# EAGLE design Demo (EAGLE 6.5.0)
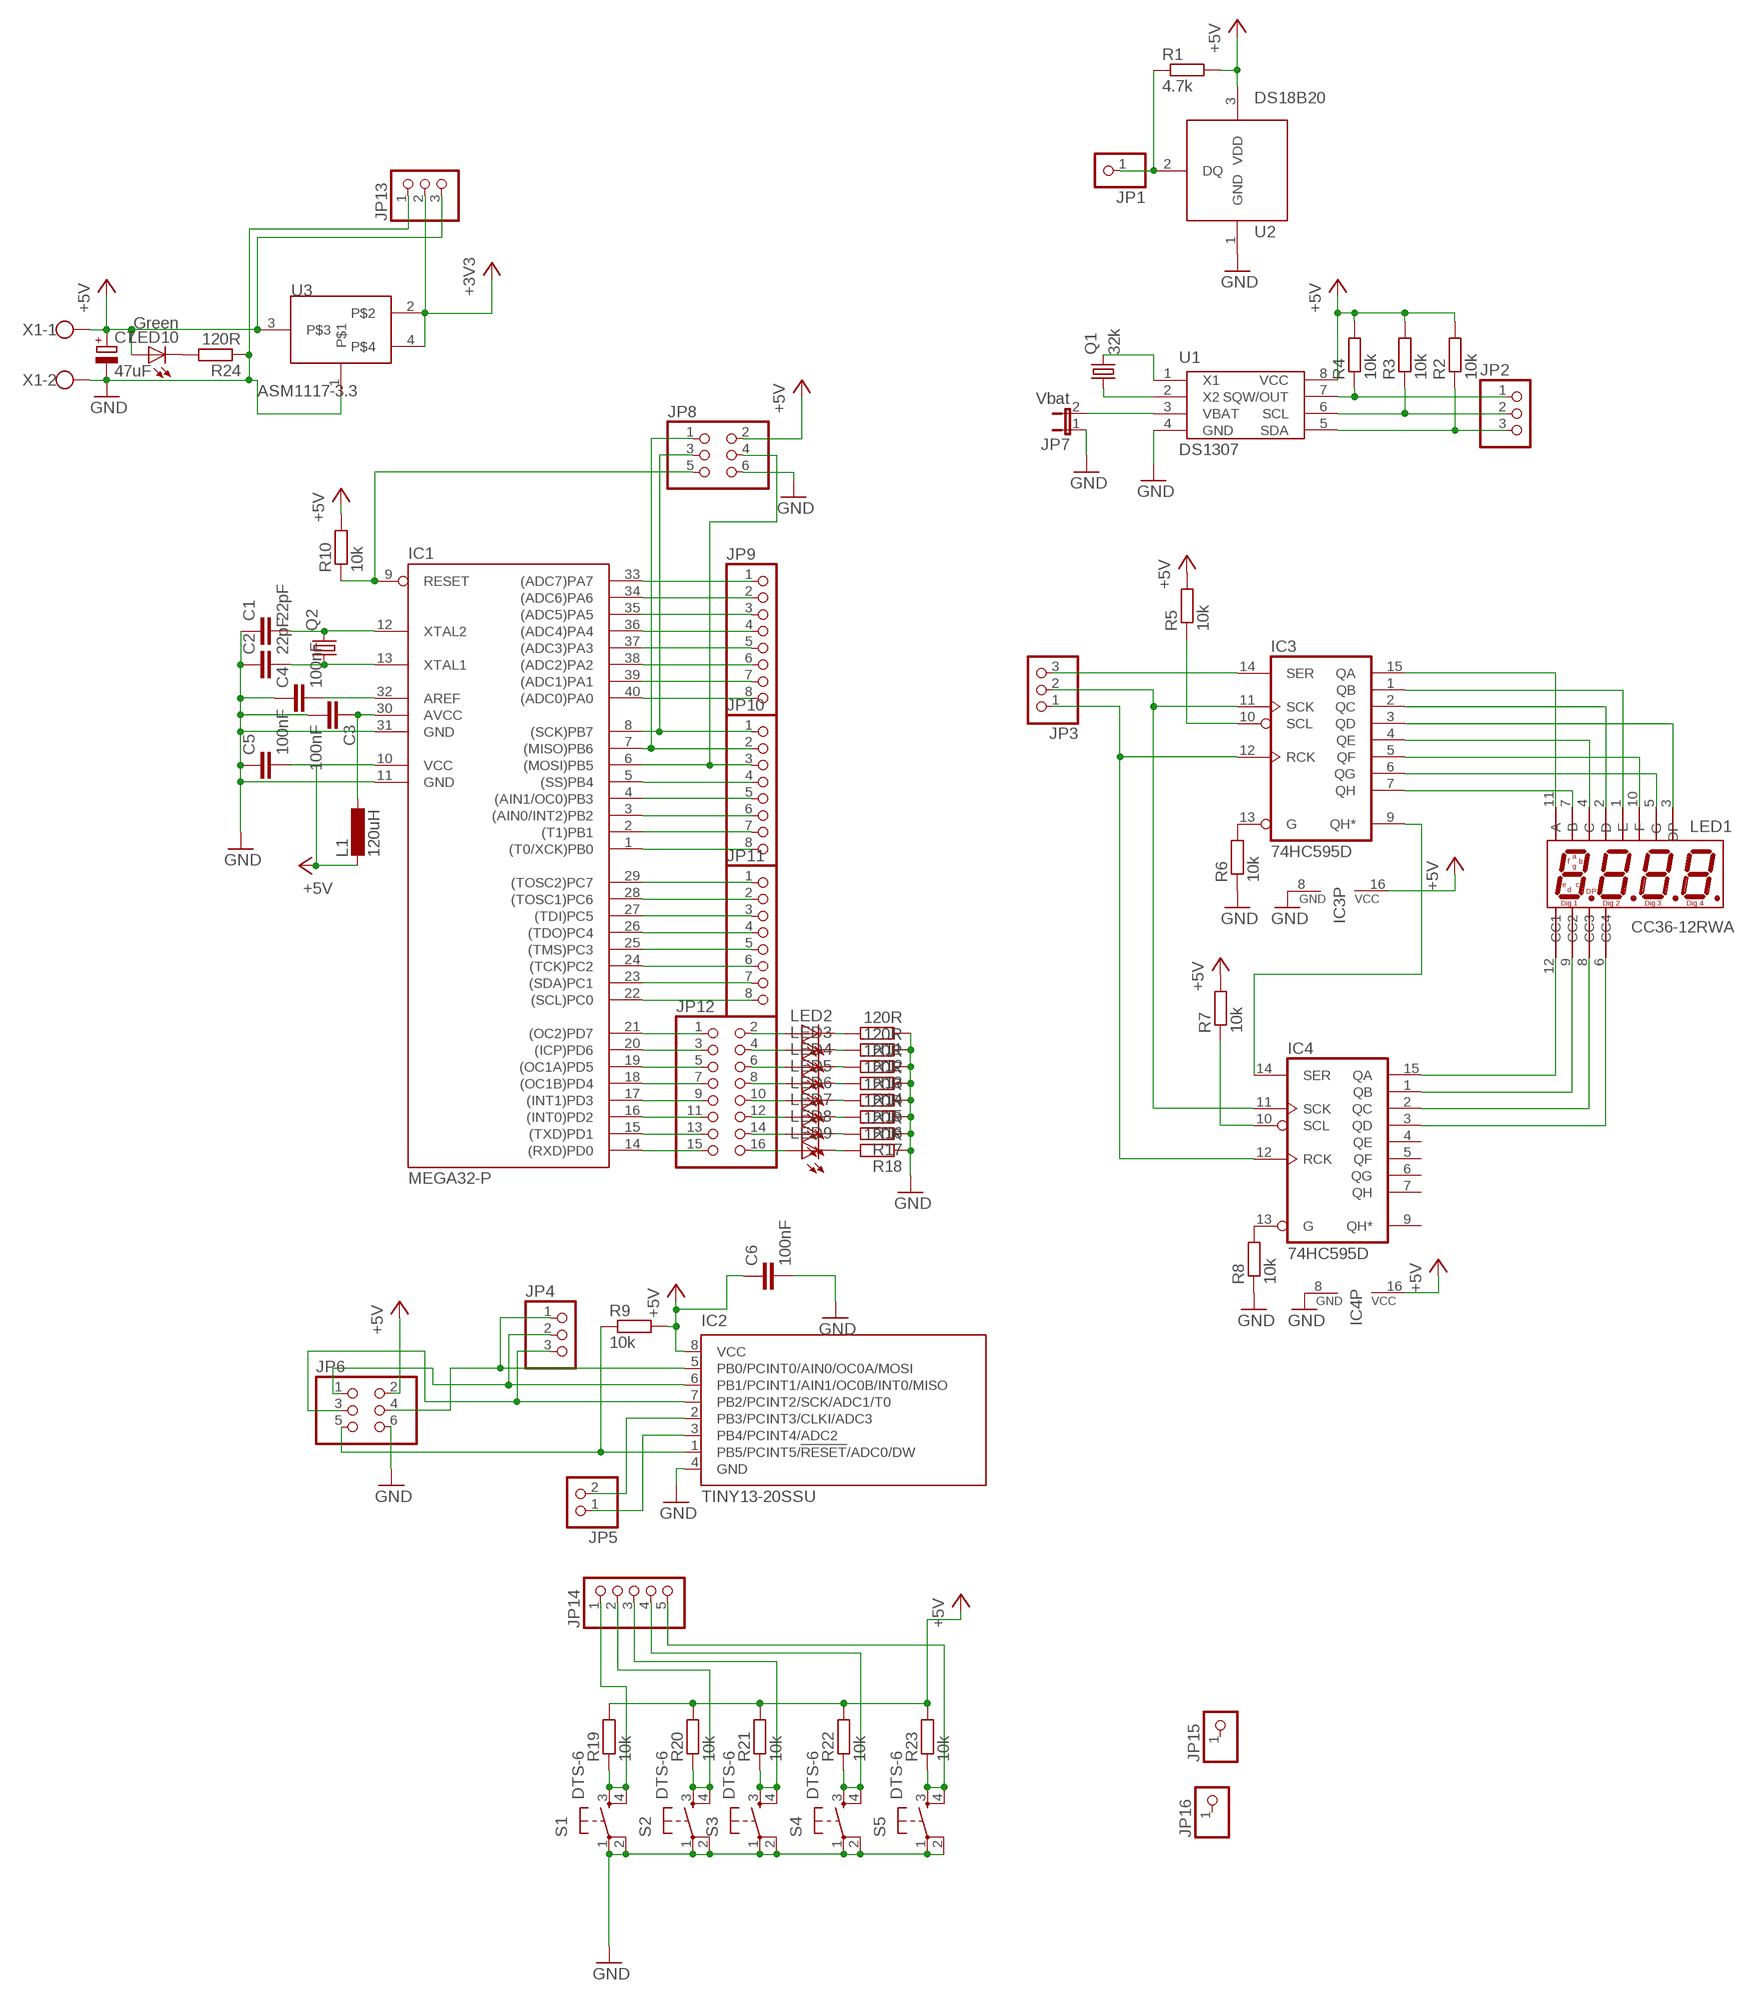
[diagram p0: schematic, sheet 1]

## Parts
C1  22pF  C-EUC0805  [C0805]
C2  22pF  C-EUC0805  [C0805]
C3  100nF  C-EUC0805  [C0805]
C4  100nF  C-EUC0805  [C0805]
C5  100nF  C-EUC0805  [C0805]
C6  100nF  C-EUC0805  [C0805]
C7  47uF  CPOL-EUE2-5  [E2-5]
IC1  MEGA32-P  [DIL40]
IC2  TINY13-20SSU  [8S1]
IC3  74HC595D  [SO16]
IC4  74HC595D  [SO16]
JP1  PINHD-1X1  [1X01]
JP2  PINHD-1X3  [1X03]
JP3  PINHD-1X3  [1X03]
JP4  PINHD-1X3  [1X03]
JP5  PINHD-1X2  [1X02]
JP6  PINHD-2X3  [2X03]
JP7  Vbat  JP1E  [JP1]
JP8  PINHD-2X3  [2X03]
JP9  PINHD-1X8  [1X08]
JP10  PINHD-1X8  [1X08]
JP11  PINHD-1X8  [1X08]
JP12  PINHD-2X8  [2X08]
JP13  PINHD-1X3  [1X03]
JP14  PINHD-1X5  [1X05]
JP15  PINHD-1X1  [1X01]
JP16  PINHD-1X1  [1X01]
L1  120uH  L-EU0204V  [0204V]
LED1  CC36-12RWA  [7SEG_4DIG]
LED2  LEDSML0603  [SML0603]
LED3  LEDSML0603  [SML0603]
LED4  LEDSML0603  [SML0603]
LED5  LEDSML0603  [SML0603]
LED6  LEDSML0603  [SML0603]
LED7  LEDSML0603  [SML0603]
LED8  LEDSML0603  [SML0603]
LED9  LEDSML0603  [SML0603]
LED10  Green  LEDSML0603  [SML0603]
Q1  32k  CRYSTALTC38H  [TC38H]
Q2  CRYSTALHC49S  [HC49/S]
R1  4.7k  R-EU_R0603  [R0603]
R2  10k  R-EU_R0603  [R0603]
R3  10k  R-EU_R0603  [R0603]
R4  10k  R-EU_R0603  [R0603]
R5  10k  R-EU_R0603  [R0603]
R6  10k  R-EU_R0603  [R0603]
R7  10k  R-EU_R0603  [R0603]
R8  10k  R-EU_R0603  [R0603]
R9  10k  R-EU_R0603  [R0603]
R10  10k  R-EU_R0603  [R0603]
R11  120R  R-EU_R0603  [R0603]
R12  120R  R-EU_R0603  [R0603]
R13  120R  R-EU_R0603  [R0603]
R14  120R  R-EU_R0603  [R0603]
R15  120R  R-EU_R0603  [R0603]
R16  120R  R-EU_R0603  [R0603]
R17  120R  R-EU_R0603  [R0603]
R18  120R  R-EU_R0603  [R0603]
R19  10k  R-EU_R0603  [R0603]
R20  10k  R-EU_R0603  [R0603]
R21  10k  R-EU_R0603  [R0603]
R22  10k  R-EU_R0603  [R0603]
R23  10k  R-EU_R0603  [R0603]
R24  120R  R-EU_R0603  [R0603]
S1  DTS-6  [DTS-6]
S2  DTS-6  [DTS-6]
S3  DTS-6  [DTS-6]
S4  DTS-6  [DTS-6]
S5  DTS-6  [DTS-6]
U1  DS1307  [SOP08]
U2  DS18B20  [TO92]
U3  ASM1117-3.3  [SOT223]
X1  W237-102  [W237-102]

## Nets
+3V3: JP13.2 U3.2 U3.4
+5V: C5.2 C6.1 C7.+ IC1.10(VCC) IC2.8(VCC) IC3.16(VCC) IC4.16(VCC) JP6.2 JP8.2 JP13.3 L1.2 LED10.A R1.2 R2.2 R3.2 R4.2 R5.2 R7.2 R9.2 R10.2 R19.2 R20.2 R21.2 R22.2 R23.2 U1.8(VCC) U2.3(VDD) U3.3 X1.1
GND: C1.1 C2.1 C3.2 C4.1 C5.1 C6.2 C7.- IC1.11(GND) IC1.31(GND) IC2.4(GND) IC3.8(GND) IC4.8(GND) JP6.6 JP7.1 JP8.6 JP13.1 R6.1 R8.1 R11.1 R12.1 R13.1 R14.1 R15.1 R16.1 R17.1 R18.1 R24.1 S1.1 S1.2 S2.1 S2.2 S3.1 S3.2 S4.1 S4.2 S5.1 S5.2 U1.4(GND) U2.1(GND) U3.1 X1.2
N$1: JP1.1 R1.1 U2.2(DQ)
N$2: Q1.1 U1.2(X2)
N$3: Q1.2 U1.1(X1)
N$4: JP7.2 U1.3(VBAT)
N$5: JP2.3 R2.1 U1.5(SDA)
N$6: JP2.2 R3.1 U1.6(SCL)
N$7: JP2.1 R4.1 U1.7(SQW/OUT)
N$8: IC3.10(SCL) R5.1
N$9: IC3.13(G) R6.2
N$10: IC4.13(G) R8.2
N$11: IC4.10(SCL) R7.1
N$12: IC3.9(QH*) IC4.14(SER)
N$13: IC3.15(QA) LED1.11(A)
N$14: IC3.1(QB) LED1.1(E)
N$15: IC3.2(QC) LED1.2(D)
N$16: IC3.3(QD) LED1.3(DP)
N$17: IC3.4(QE) LED1.4(C)
N$18: IC3.5(QF) LED1.10(F)
N$19: IC3.6(QG) LED1.5(G)
N$20: IC3.7(QH) LED1.7(B)
N$21: IC4.15(QA) LED1.12(CC1)
N$22: IC4.1(QB) LED1.9(CC2)
N$23: IC4.2(QC) LED1.8(CC3)
N$24: IC4.3(QD) LED1.6(CC4)
N$25: IC3.14(SER) JP3.3
N$26: IC3.11(SCK) IC4.11(SCK) JP3.2
N$27: IC3.12(RCK) IC4.12(RCK) JP3.1
N$28: IC2.1(PB5/PCINT5/!RESET!/ADC0/DW) JP6.5 R9.1
N$29: C1.2 IC1.12(XTAL2) Q2.2
N$30: IC2.6(PB1/PCINT1/AIN1/OC0B/INT0/MISO) JP4.2 JP6.1
N$31: IC2.7(PB2/PCINT2/SCK/ADC1/T0) JP4.3 JP6.3
N$32: IC2.5(PB0/PCINT0/AIN0/OC0A/MOSI) JP4.1 JP6.4
N$33: IC2.3(PB4/PCINT4/ADC2) JP5.1
N$34: IC2.2(PB3/PCINT3/CLKI/ADC3) JP5.2
N$35: C2.2 IC1.13(XTAL1) Q2.1
N$36: C4.2 IC1.32(AREF)
N$37: LED10.C R24.2
N$38: C3.1 IC1.30(AVCC) L1.1
N$39: IC1.9(RESET) JP8.5 R10.1
N$40: IC1.33((ADC7)PA7) JP9.1
N$41: IC1.34((ADC6)PA6) JP9.2
N$42: IC1.35((ADC5)PA5) JP9.3
N$43: IC1.36((ADC4)PA4) JP9.4
N$44: IC1.37((ADC3)PA3) JP9.5
N$45: IC1.38((ADC2)PA2) JP9.6
N$46: IC1.39((ADC1)PA1) JP9.7
N$47: IC1.40((ADC0)PA0) JP9.8
N$48: IC1.8((SCK)PB7) JP8.3 JP10.1
N$49: IC1.7((MISO)PB6) JP8.1 JP10.2
N$50: IC1.6((MOSI)PB5) JP8.4 JP10.3
N$51: IC1.5((SS)PB4) JP10.4
N$52: IC1.4((AIN1/OC0)PB3) JP10.5
N$53: IC1.3((AIN0/INT2)PB2) JP10.6
N$54: IC1.2((T1)PB1) JP10.7
N$55: IC1.1((T0/XCK)PB0) JP10.8
N$56: IC1.29((TOSC2)PC7) JP11.1
N$57: IC1.28((TOSC1)PC6) JP11.2
N$58: IC1.27((TDI)PC5) JP11.3
N$59: IC1.26((TDO)PC4) JP11.4
N$60: IC1.25((TMS)PC3) JP11.5
N$61: IC1.24((TCK)PC2) JP11.6
N$62: IC1.23((SDA)PC1) JP11.7
N$63: IC1.22((SCL)PC0) JP11.8
N$64: IC1.21((OC2)PD7) JP12.1
N$65: IC1.20((ICP)PD6) JP12.3
N$66: IC1.19((OC1A)PD5) JP12.5
N$67: IC1.18((OC1B)PD4) JP12.7
N$68: IC1.17((INT1)PD3) JP12.9
N$69: IC1.16((INT0)PD2) JP12.11
N$70: IC1.15((TXD)PD1) JP12.13
N$71: IC1.14((RXD)PD0) JP12.15
N$72: JP12.2 LED2.A
N$73: JP12.4 LED3.A
N$74: JP12.6 LED4.A
N$75: JP12.8 LED5.A
N$76: JP12.10 LED6.A
N$77: JP12.12 LED7.A
N$78: JP12.14 LED8.A
N$79: JP12.16 LED9.A
N$80: LED2.C R11.2
N$81: LED3.C R12.2
N$82: LED4.C R13.2
N$83: LED5.C R14.2
N$84: LED6.C R15.2
N$85: LED7.C R16.2
N$86: LED8.C R17.2
N$87: LED9.C R18.2
N$92: JP14.1 R19.1 S1.3 S1.4
N$93: JP14.2 R20.1 S2.3 S2.4
N$94: JP14.3 R21.1 S3.3 S3.4
N$95: JP14.4 R22.1 S4.3 S4.4
N$96: JP14.5 R23.1 S5.3 S5.4
Unconnected: IC4.4(QE) IC4.5(QF) IC4.6(QG) IC4.7(QH) IC4.9(QH*) JP15.1 JP16.1

## Library data of the parts
C1-C6 = rcl:C-EU: CAPACITOR, European symbol
C7 = rcl:CPOL-EU: POLARIZED CAPACITOR, European symbol
IC1 = atmel:MEGA32-P: MICROCONTROLLER 32 Kbytes FLASH 2 Kbytes SRAM 1 Kbytes EEPROM USART 8-channel 10 bit ADC Source: www.atmel.com .. doc2503.pdf; MPN: ATMEGA32-16PU; OC_FARNELL: 1661729; OC_NEWARK: 51P1794
IC2 = atmel:TINY13: 8-bit AVR Microcontroller with 1K Bytes In-System Programmable Flash Source: http://www.atmel.com/dyn/resources/prod_documents/2535S.pdf; MPN: ATTINY13-20SSU; OC_FARNELL: 1455133; OC_NEWARK: 58M3771
IC3 IC4 = 74xx-eu:74*595: 8-bit SHIFT REGISTER, output latch
JP1 JP15 JP16 = pinhead:PINHD-1X1: PIN HEADER
JP2-JP4 JP13 = pinhead:PINHD-1X3: PIN HEADER
JP5 = pinhead:PINHD-1X2: PIN HEADER
JP6 JP8 = pinhead:PINHD-2X3: PIN HEADER
JP7 = jumper:JP1E: JUMPER
JP9-JP11 = pinhead:PINHD-1X8: PIN HEADER
JP12 = pinhead:PINHD-2X8: PIN HEADER
JP14 = pinhead:PINHD-1X5: PIN HEADER
L1 = rcl:L-EU: INDUCTOR, European symbol
LED1 = usb:CC36-12RWA: 7 Segment 4 Digit 0.36inch Common Catode
LED2-LED10 = led:LED: LED OSRAM: - CHIPLED LG R971, LG N971, LY N971, LG Q971, LY Q971, LO R971, LY R971 LH N974, LH R974 LS Q976, LO Q976, LY Q976 LO Q996 - Hyper CHIPLED LW Q18S LB Q993, LB Q99A, LB R99A - SideLED LS A670, LO A670, LY A670, LG A670, LP A670 LB A673, LV A673, LT A673, LW A673 LH A674 LY A675 LS A676, LA A676, LO A676, LY A676, LW A676 LS A679, LY A679, LG A679 - Hyper Micro SIDELED® LS Y876, LA Y876, LO Y876, LY Y876 LT Y87S - SmartLED LW L88C, LW L88S LB L89C, LB L89S, LG L890 LS L89K, LO L89K, LY L89K LS L896, LA L896, LO L896, LY L896 - TOPLED LS T670, LO T670, LY T670, LG T670, LP T670 LSG T670, LSP T670, LSY T670, LOP T670, LYG T670 LG T671, LOG T671, LSG T671 LB T673, LV T673, LT T673, LW T673 LH T674 LS T676, LA T676, LO T676, LY T676, LB T676, LH T676, LSB T676, LW T676 LB T67C, LV T67C, LT T67C, LS T67K, LO T67K, LY T67K, LW E67C LS E67B, LA E67B, LO E67B, LY E67B, LB E67C, LV E67C, LT E67C LW T67C LS T679, LY T679, LG T679 LS T770, LO T770, LY T770, LG T770, LP T770 LB T773, LV T773, LT T773, LW T773 LH T774 LS E675, LA E675, LY E675, LS T675 LS T776, LA T776, LO T776, LY T776, LB T776 LHGB T686 LT T68C, LB T68C - Hyper Mini TOPLED® LB M676 - Mini TOPLED Santana® LG M470 LS M47K, LO M47K, LY M47K Source: http://www.osram.convergy.de LUXEON: - LUMILED® LXK2-PW12-R00, LXK2-PW12-S00, LXK2-PW14-U00, LXK2-PW14-V00 LXK2-PM12-R00, LXK2-PM12-S00, LXK2-PM14-U00 LXK2-PE12-Q00, LXK2-PE12-R00, LXK2-PE12-S00, LXK2-PE14-T00, LXK2-PE14-U00 LXK2-PB12-K00, LXK2-PB12-L00, LXK2-PB12-M00, LXK2-PB14-N00, LXK2-PB14-P00, LXK2-PB14-Q00 LXK2-PR12-L00, LXK2-PR12-M00, LXK2-PR14-Q00, LXK2-PR14-R00 LXK2-PD12-Q00, LXK2-PD12-R00, LXK2-PD12-S00 LXK2-PH12-R00, LXK2-PH12-S00 LXK2-PL12-P00, LXK2-PL12-Q00, LXK2-PL12-R00 Source: www.luxeon.com KINGBRIGHT: KA-3528ASYC Source: www.kingbright.com
Q1 = crystal:CRYSTAL: CRYSTAL; OC_FARNELL: unknown; OC_NEWARK: unknown
Q2 = crystal:CRYSTAL: CRYSTAL; OC_FARNELL: 1667008; OC_NEWARK: unknown
R1-R24 = rcl:R-EU_: RESISTOR, European symbol
S1-S5 = switch-tact:DTS-6
U1 = usb:DS1307: Real-Time Clock DS1307
U2 = usb:DS18B20: DS18B20
U3 = Itead_IC_110429:ASM1117-3.3: ICP006
X1 = con-wago-500:W237-102: WAGO SCREW CLAMP; MPN: 237-102; OC_FARNELL: unknown; OC_NEWARK: 70K9898

## Board
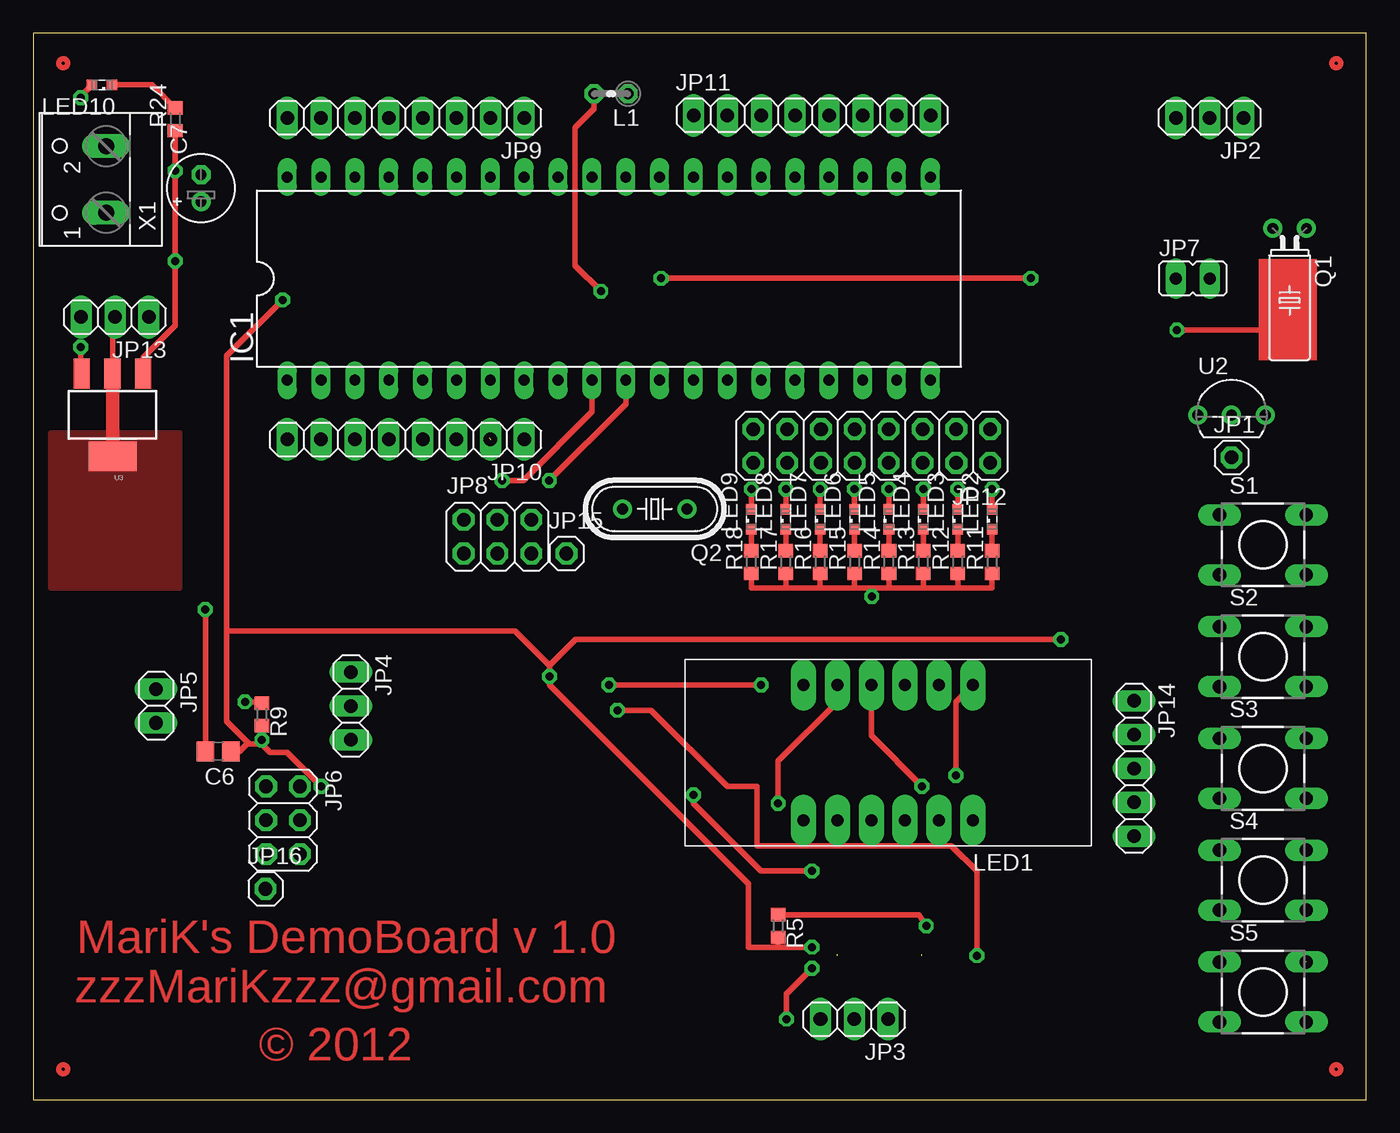
[diagram p1: board, top side]
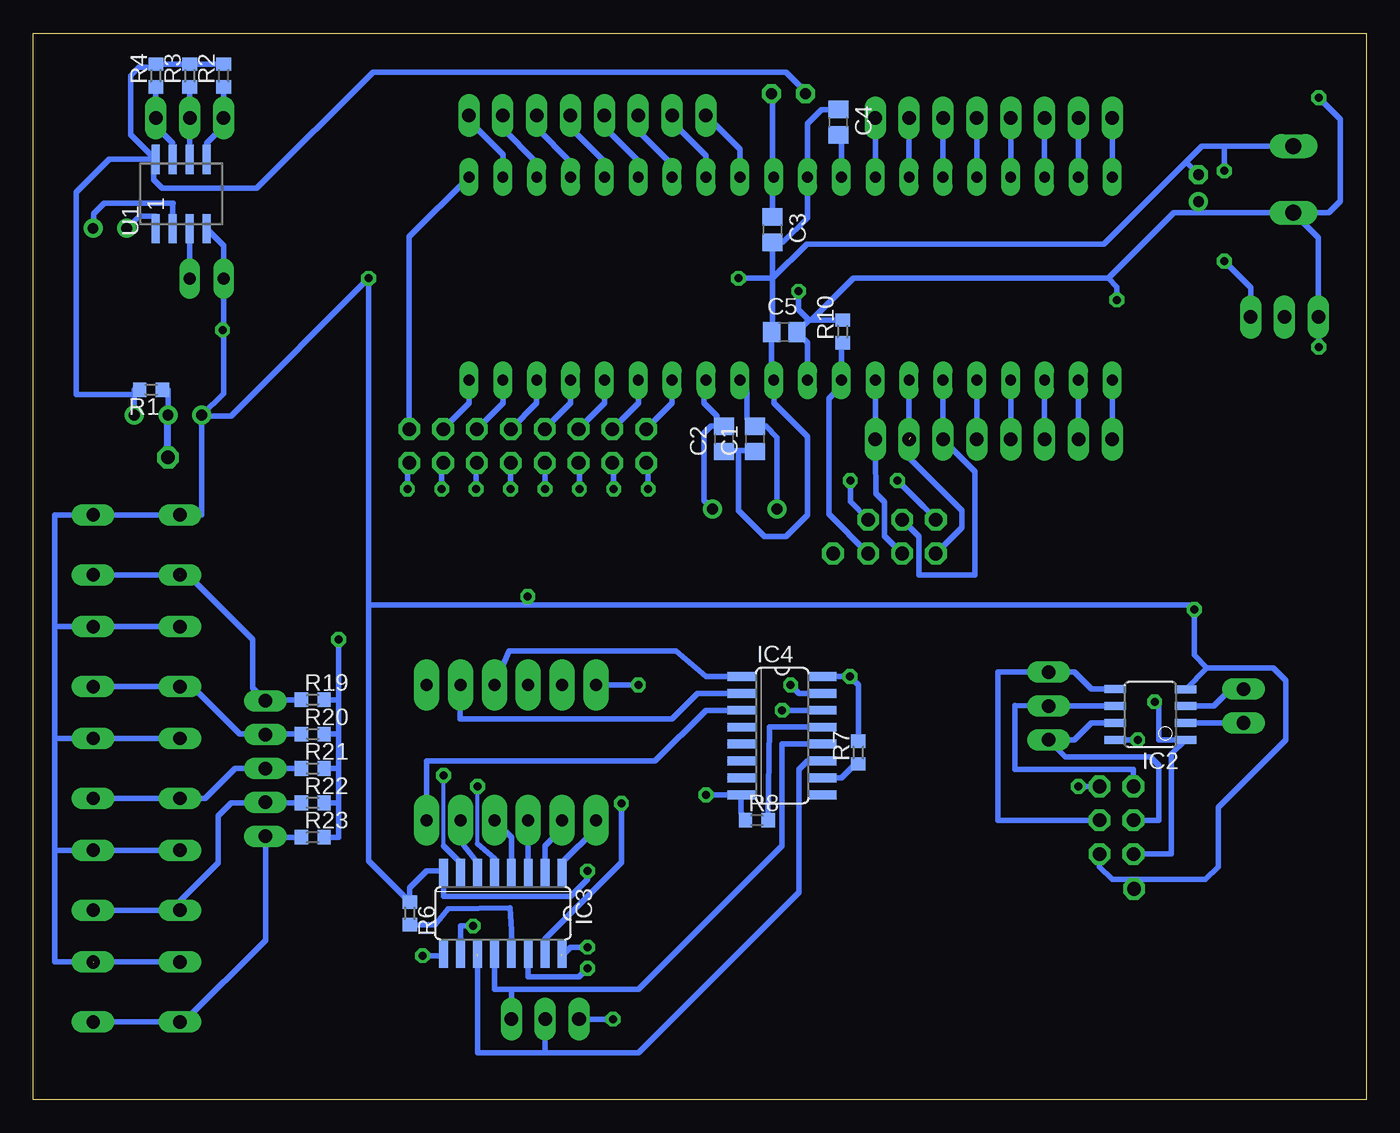
[diagram p2: board, bottom side, seen from below]

Size 100 x 80 mm. Coordinates in mm from the lower left corner, seen from the top.
Outline: 0,0 100,0 100,80 0,80 0,0
Copper layers (1*16): Top 0.035mm / dielectric 1.5mm / Bottom 0.035mm
Design rules "default": minimum track width 12mil, minimum drill 20mil, track to track 12mil, track to pad 12mil, pad to pad 12mil, via to via 12mil, smd to smd 8mil, copper to edge 20mil, drill to drill 40mil, minimum pad ring 12mil, minimum via ring 10mil, stop-mask expansion 4mil, vias tented up to drill 0mil, thermal gap 10mil

### Footprints (pad centres in the part's own frame; a part is rotated, then mirrored left to right if it is on the bottom)
C0805 = smd 1.3 x 1.5: 1 -0.95,0; 2 0.95,0
E2-5 = drill 0.813 pad 1.27: + -1.016,0 | drill 0.813 pad 1.27 octagon: - 1.016,0
DIL40 = drill 0.813 long: 1 -24.13,-7.62; 2 -21.59,-7.62; 3 -19.05,-7.62; 4 -16.51,-7.62; 5 -13.97,-7.62; 6 -11.43,-7.62; 7 -8.89,-7.62; 8 -6.35,-7.62; 9 -3.81,-7.62; 10 -1.27,-7.62; 11 1.27,-7.62; 12 3.81,-7.62; 13 6.35,-7.62; 14 8.89,-7.62; 15 11.43,-7.62; 16 13.97,-7.62; 17 16.51,-7.62; 18 19.05,-7.62; 19 21.59,-7.62; 20 24.13,-7.62; 21 24.13,7.62; 22 21.59,7.62; 23 19.05,7.62; 24 16.51,7.62; 25 13.97,7.62; 26 11.43,7.62; 27 8.89,7.62; 28 6.35,7.62; 29 3.81,7.62; 30 1.27,7.62; 31 -1.27,7.62; 32 -3.81,7.62; 33 -6.35,7.62; 34 -8.89,7.62; 35 -11.43,7.62; 36 -13.97,7.62; 37 -16.51,7.62; 38 -19.05,7.62; 39 -21.59,7.62; 40 -24.13,7.62
8S1 = smd 0.6 x 1.6: 1 -1.905,-2.654; 2 -0.645,-2.654; 3 0.625,-2.654; 4 1.895,-2.654; 5 1.905,2.654; 6 0.635,2.654; 7 -0.635,2.654; 8 -1.905,2.654
SO16 = smd 0.66 x 2.032: 1 -4.445,-3.073; 2 -3.175,-3.073; 3 -1.905,-3.073; 4 -0.635,-3.073; 5 0.635,-3.073; 6 1.905,-3.073; 7 3.175,-3.073; 8 4.445,-3.073; 9 4.445,3.073; 10 3.175,3.073; 11 1.905,3.073; 12 0.635,3.073; 13 -0.635,3.073; 14 -1.905,3.073; 15 -3.175,3.073; 16 -4.445,3.073
1X01 = drill 1.016 octagon: 1 0,0
1X03 = drill 1.016 long: 1 -2.54,0; 2 0,0; 3 2.54,0
1X02 = drill 1.016 long: 1 -1.27,0; 2 1.27,0
2X03 = drill 1.016 octagon: 1 -2.54,-1.27; 2 -2.54,1.27; 3 0,-1.27; 4 0,1.27; 5 2.54,-1.27; 6 2.54,1.27
JP1 = drill 0.914 long: 1 0,-1.27; 2 0,1.27
1X08 = drill 1.016 long: 1 -8.89,0; 2 -6.35,0; 3 -3.81,0; 4 -1.27,0; 5 1.27,0; 6 3.81,0; 7 6.35,0; 8 8.89,0
2X08 = drill 1.016 octagon: 1 -8.89,-1.27; 2 -8.89,1.27; 3 -6.35,-1.27; 4 -6.35,1.27; 5 -3.81,-1.27; 6 -3.81,1.27; 7 -1.27,-1.27; 8 -1.27,1.27; 9 1.27,-1.27; 10 1.27,1.27; 11 3.81,-1.27; 12 3.81,1.27; 13 6.35,-1.27; 14 6.35,1.27; 15 8.89,-1.27; 16 8.89,1.27
1X05 = drill 1.016 long: 1 -5.08,0; 2 -2.54,0; 3 0,0; 4 2.54,0; 5 5.08,0
0204V = drill 0.813 octagon: 1 -1.27,0; 2 1.27,0
7SEG_4DIG = drill 0.9 pad 1.93 long: 1 -6.35,-5.08; 2 -3.81,-5.08; 3 -1.27,-5.08; 4 1.27,-5.08; 5 3.81,-5.08; 6 6.35,-5.08; 7 6.35,5.08; 8 3.81,5.08; 9 1.27,5.08; 10 -1.27,5.08; 11 -3.81,5.08; 12 -6.35,5.08
SML0603 = smd 0.8 x 0.8: A 0.75,0; C -0.75,0
TC38H = drill 0.813: 1 -1.27,0; 2 1.27,0
HC49/S = drill 0.813: 1 -2.413,0; 2 2.413,0
R0603 = smd 1 x 1.1: 1 -0.85,0; 2 0.85,0
DTS-6 = drill 1 long: 1 -3.25,2.25; 2 3.25,2.25; 3 -3.25,-2.25; 4 3.25,-2.25
SOP08 = smd 0.6 x 2.2: 1 -1.905,-2.6; 2 -0.635,-2.6; 3 0.635,-2.6; 4 1.905,-2.6; 5 1.905,2.6; 6 0.635,2.6; 7 -0.635,2.6; 8 -1.905,2.6
TO92 = drill 0.813: 1 -2.54,0; 2 0,0; 3 2.54,0
SOT223 = smd 1.219 x 2.235: 1 -2.311,-3.099; 2 0,-3.099; 3 2.311,-3.099 | smd 3.6 x 2.2: 4 0,3.099
W237-102 = drill 1.194 long: 1 -2.5,-1.27; 2 2.5,-1.27

### Placement (x,y rotation side)
C1  45.86,49.57 90 bottom
C2  48.18,49.57 90 bottom
C3  44.54,65.27 270 bottom
C4  39.61,73.34 270 bottom
C5  43.66,57.58 0 bottom
C6  13.87,26.13 180 top
C7  12.58,68.39 90 top
IC1  43.18,61.59 0 top
IC2  16.19,28.89 90 bottom
IC3  64.77,13.97 180 bottom
IC4  43.81,27.3 270 bottom
JP1  89.9,48.17 0 top
JP2  88.27,73.66 180 top
JP3  61.59,6.03 180 top
JP4  23.82,29.53 270 top
JP5  9.21,29.53 270 top
JP6  18.73,20.95 270 top
JP7  87,61.59 270 top
JP8  34.82,42.24 0 top
JP9  27.94,73.66 180 top
JP10  27.94,49.53 180 top
JP11  58.43,73.85 0 top
JP12  62.9,49.03 180 top
JP13  6.13,58.71 180 top
JP14  82.58,24.84 270 top
JP15  40,40.97 0 top
JP16  17.42,15.81 0 top
L1  43.35,75.47 180 top
LED1  64.14,26.04 0 top
LED2  71.94,43.55 90 top
LED3  69.35,43.55 90 top
LED4  66.77,43.55 90 top
LED5  64.19,43.55 90 top
LED6  61.61,43.55 90 top
LED7  59.03,43.55 90 top
LED8  56.45,43.55 90 top
LED9  53.87,43.55 90 top
LED10  5.16,76.13 180 top
Q1  94.25,65.36 180 top
Q2  46.62,44.31 180 top
R1  91.17,53.25 180 bottom
R2  85.72,76.83 90 bottom
R3  88.27,76.83 90 bottom
R4  90.81,76.83 90 bottom
R5  55.88,13.02 270 top
R6  71.75,13.97 270 bottom
R7  38.1,26.04 90 bottom
R8  45.72,20.95 0 bottom
R9  17.14,28.89 270 top
R10  39.28,57.64 90 bottom
R11  71.94,40.32 90 top
R12  69.35,40.32 90 top
R13  66.77,40.32 90 top
R14  64.19,40.32 90 top
R15  61.61,40.32 90 top
R16  59.03,40.32 90 top
R17  56.45,40.32 90 top
R18  53.87,40.32 90 top
R19  79.03,30 0 bottom
R20  79.03,27.42 0 bottom
R21  79.03,24.84 0 bottom
R22  79.03,22.26 0 bottom
R23  79.03,19.68 0 bottom
R24  10.65,73.55 90 top
S1  92.26,41.61 0 top
S2  92.26,33.23 0 top
S3  92.26,24.84 0 top
S4  92.26,16.45 0 top
S5  92.26,8.06 0 top
U1  88.9,67.94 0 bottom
U2  89.9,51.35 0 top
U3  5.94,51.36 180 top
X1  4.19,69.03 90 top

### Tracks (layer width: path | path; a pad name or v marks a point on that pad's centre or on a via)
+3V3
  Top 0.406: U3.2 5.94,58.52 JP13.2
  Top 1.016: U3.2 U3.4
  pour Top (no thermals): 1.29,38.39 10.97,38.39 10.97,50 1.29,50
+5V  (via drill 0.6)  (1 unrouted)
  Top 0.406: 55.88,11.43 53.66,11.43 53.66,16.19 38.73,31.11 v38.73,31.75 38.73,32.55 | 55.88,11.43 v58.42,11.43 | R5.2 55.88,11.43 | R9.2 v17.14,26.99 17.14,26.67 | v21.59,23.5 19.05,26.04 17.78,26.04 17.14,26.67 | v35.16,46.45 36.77,46.45 41.94,51.61 41.94,53.95 IC1.10 | L1.2 42.08,74.34 40.65,72.9 40.65,62.58 v42.58,60.65 | 17.14,26.67 16.23,26.67 16.13,26.77 | 16.13,26.77 14.52,28.39 14.52,35.16 | 14.52,35.16 14.52,55.81 v18.71,60 | 38.73,32.55 36.13,35.16 14.52,35.16 | C6.1 15.48,26.13 16.13,26.77 | v3.55,56.45 3.55,54.54 U3.3 | v77.1,34.52 40.7,34.52 38.73,32.55 | LED10.A 3.55,75.27 v3.55,75.16
  Bottom 0.406: U1.8 90.86,70.55 92.71,72.39 92.71,76.83 92.08,77.47 90.81,77.47 R4.2 R3.2 R2.2 | R1.2 92.44,53.25 92.44,52.9 | 92.44,52.9 U2.3 | IC4.16 v38.73,31.75 38.1,31.11 R7.2 | v58.42,11.43 59.69,11.43 60.33,10.79 | v17.14,26.99 IC2.8 | JP6.2 v21.59,23.5 | IC1.10 41.91,56.78 C5.2 41.81,58.48 | JP8.2 33.23,44.5 33.55,44.84 v35.16,46.45 | R10.2 41.61,58.48 | 41.61,58.48 41.81,58.48 | v42.58,60.65 42.58,59.26 41.81,58.48 | X1.1 12.9,66.53 | 12.9,66.53 14.44,66.53 19.36,61.61 | 19.36,61.61 38.48,61.61 41.61,58.48 | v18.71,60 18.71,60.97 19.36,61.61 | U1.8 94.29,70.55 96.77,68.06 96.77,52.88 92.44,52.9 | L1.2 42.08,75.63 43.55,77.1 74.52,77.1 83.23,68.39 90.32,68.39 90.97,69.03 90.97,70.64 90.91,70.64 U1.8 | X1.1 3.59,64.66 JP13.3 3.55,58.71 v3.55,56.45 | 77.1,22.26 77.1,19.68 R23.2 | R22.2 77.1,22.26 | 77.1,22.26 77.1,24.84 | R21.2 77.1,24.84 | 77.1,24.84 77.1,27.42 | 77.1,27.42 R20.2 | R20.2 | R20.2 77.1,27.42 | 77.1,27.42 77.1,30 R19.2 | 77.1,27.42 v77.1,34.52 | C7.+ 12.58,66.73 12.9,66.53 | v3.55,75.16 1.94,73.55 1.94,67.42 2.82,66.53 X1.1
GND  (via drill 0.6)  (2 unrouted)
  Top 0.406: v58.42,17.14 54.61,17.14 49.53,22.23 v49.53,22.86 | v38.71,46.45 44.45,52.19 IC1.11 | v74.84,61.61 v47.1,61.61 | C6.2 12.92,36.76 v12.9,36.77 | U3.1 8.25,55.67 10.64,58.06 v10.64,62.9 v10.64,69.68 R24.1 | R18.1 53.87,38.39 56.45,38.39 | 56.45,38.39 R17.1 | R16.1 59.03,38.39 | 59.03,38.39 56.45,38.39 | R15.1 61.61,38.39 | 61.61,38.39 59.03,38.39 | R14.1 64.19,38.39 | 64.19,38.39 62.9,38.39 | 62.9,38.39 61.61,38.39 | R13.1 66.77,38.39 | 66.77,38.39 64.19,38.39 | R12.1 69.36,38.39 | 69.36,38.39 66.77,38.39 | R11.1 71.94,38.39 69.36,38.39 | v62.9,37.74 62.9,38.39 | R24.1
  Bottom 0.406: IC4.8 46.89,21.49 46.57,21.17 | 46.57,21.17 46.35,20.95 | U1.4 85.72,64.08 JP7.1 85.72,52.98 U2.1 | v58.42,17.14 58.42,16.51 59.69,15.24 69.22,15.24 IC3.8 69.32,17.14 70.48,17.14 71.75,15.88 R6.1 74.84,17.9 74.84,37.1 | v49.53,22.86 IC4.8 | 46.57,21.17 R8.1 | 46.67,22.86 IC4.8 | IC2.4 11.94,32.38 | 11.94,32.38 6.99,32.38 6.03,31.43 6.03,26.99 11.11,21.91 11.11,17.46 12.06,16.51 19.05,16.51 20,17.46 JP6.6 | JP8.6 38.71,44.85 v38.71,46.45 | 44.54,61.61 44.54,57.65 C5.1 44.61,54.13 IC1.11 44.45,52.26 41.94,49.74 41.94,43.87 43.55,42.26 45.16,42.26 47.1,44.19 47.1,48.71 | 44.54,61.61 C3.2 43.74,64.32 41.94,66.13 41.94,69.19 IC1.31 41.94,69.24 41.94,73.23 40.87,74.29 C4.1 | X1.2 10.64,71.53 | 13.55,70.32 12.34,71.53 10.64,71.53 | 13.55,70.32 19.68,64.19 41.96,64.19 44.54,61.61 | U2.1 86.77,51.29 85.16,51.29 v74.84,61.61 74.84,37.1 | v47.1,61.61 44.54,61.61 | C2.1 48.09,48.71 47.1,48.71 | C1.1 45.95,48.71 | 45.95,48.71 47.1,48.71 | 45.81,48.71 45.95,48.71 | 62.9,37.1 13.23,37.1 v12.9,36.77 12.9,33.35 11.94,32.38 | 62.9,37.1 74.84,37.1 | JP13.1 8.67,60.93 v10.64,62.9 | v10.64,69.68 10.64,71.53 | v62.9,37.74 62.9,37.1 | S5.1 95.48,10.31 95.48,10.32 98.39,10.32 98.39,18.71 | 89.03,18.71 S4.2 | 98.39,18.71 98.39,27.1 | 98.39,27.1 S3.2 S3.1 | 98.39,18.71 S4.2 | S4.2 | S2.1 S2.2 98.39,35.48 | 98.39,35.48 98.39,27.1 | 98.39,35.48 98.39,43.86 S1.2 S1.1 87.36,43.86 U2.1 | C7.- 13.55,70.37 13.55,70.32
N$1
  Bottom 0.406: U2.2 JP1.1 90,48.27 90,51.29 89.95,51.29 U2.2 | R1.1 89.9,53.25 U2.2
N$2
  Bottom 0.406: Q1.1 95.48,65.4 95.48,66.45 94.68,67.26 89.52,67.26 89.53,67.24 U1.2
N$3
  Bottom 0.406: Q1.2 92.06,66.29 90.81,66.29 U1.1
N$4
  Bottom 0.406: U1.3 JP7.2
N$5
  Bottom 0.406: R2.1 JP2.3 85.72,73.03 87,71.75 U1.5
N$6
  Bottom 0.406: U1.6 JP2.2 R3.1
N$7
  Bottom 0.406: U1.7 89.53,71.75 90.81,73.03 JP2.1 R4.1
N$8  (via drill 0.6)
  Top 0.406: v66.99,13.02 66.46,13.87 R5.1
  Bottom 0.406: IC3.10 67.94,13.02 v66.99,13.02
N$9
  Bottom 0.406: R6.2 69.85,13.12 68.9,14.29 64.24,14.39 64.14,12.7 IC3.13 64.14,10.79
N$10
  Bottom 0.406: R8.2 44.77,27.94 IC4.13 40.64,27.94
N$11
  Bottom 0.406: IC4.10 39.37,24.13 38.1,25.4 R7.1
N$12  (via drill 0.6)
  Top 0.406: v70.8,10.79 70.8,17.14 68.9,19.05 54.29,19.05 54.29,23.5 52.07,23.5 46.35,29.21 v43.81,29.21
  Bottom 0.406: IC4.14 v43.81,29.21 | v70.8,10.79 69.32,10.79 IC3.9
N$13  (via drill 0.6)
  Top 0.406: v55.88,22.23 55.88,25.4 60.33,29.84 LED1.11
  Bottom 0.406: IC3.15 61.59,12.06 55.88,17.78 v55.88,22.23
N$14
  Bottom 0.406: LED1.1 57.78,20.32 60.33,17.78 IC3.1
N$15
  Bottom 0.406: LED1.2 60.33,20.32 61.59,19.05 IC3.2
N$16
  Bottom 0.406: LED1.3 IC3.3
N$17
  Bottom 0.406: LED1.4 64.14,19.68 IC3.4
N$18  (via drill 0.6)
  Top 0.406: v66.67,23.5 62.87,27.3 LED1.10
  Bottom 0.305: 66.67,19.19 v66.67,23.5
  Bottom 0.406: IC3.5 65.41,18.08 66.67,19.19
N$19
  Bottom 0.406: LED1.5 67.94,19.35 66.67,17.76 IC3.6
N$20  (via drill 0.6)
  Top 0.406: v69.22,24.32 69.22,29.84 LED1.7
  Bottom 0.305: 69.22,19.04 v69.22,24.32
  Bottom 0.406: IC3.7 67.94,17.77 69.22,19.04
N$21  (via drill 0.6)
  Top 0.406: v43.18,31.11 v54.61,31.11
  Bottom 0.406: IC4.15 42.55,30.48 v43.18,31.11 | v54.61,31.11 LED1.12
N$22
  Bottom 0.406: IC4.1 49.53,31.75 51.77,33.66 64.31,33.66 LED1.9
N$23
  Bottom 0.406: IC4.2 50.16,30.48 52.08,28.57 67.97,28.57 LED1.8
N$24
  Bottom 0.406: LED1.6 70.48,25.4 53.34,25.4 49.53,29.21 IC4.3
N$25  (via drill 0.6)
  Top 0.406: v58.42,9.84 56.52,7.94 v56.52,6.03
  Bottom 0.406: IC3.14 62.87,9.21 59.05,9.21 v58.42,9.84 | v56.52,6.03 JP3.3
N$26  (1 unrouted)
  Bottom 0.406: IC4.11 41.91,25.4 42.55,24.77 42.55,15.56 54.61,3.49 61.59,3.49 | 61.59,3.49 66.67,3.49 66.67,10.79 | JP3.2 61.59,3.49
N$27
  Bottom 0.406: IC4.12 43.81,26.67 43.81,19.05 54.61,8.26 64.14,8.26 | 64.14,8.26 65.41,8.26 IC3.12 | JP3.1 64.14,8.26
N$28  (via drill 0.6)
  Top 0.406: R9.1 17.04,29.84 v15.88,29.84
  Bottom 0.406: v15.88,29.84 15.56,29.53 15.56,26.99 IC2.1 14.61,25.92 14.61,18.41 JP6.5
N$29
  Bottom 0.406: Q2.2 44.19,44.33 44.19,49.68 45.03,50.52 C1.2 46.45,51.11 46.45,53.23 46.99,53.76 IC1.12
N$30
  Bottom 0.406: IC2.6 JP4.2 26.36,29.56 26.36,24.77 17.46,24.77 JP6.1
N$31
  Bottom 0.406: IC2.7 20.64,28.26 21.91,26.99 JP4.3 22.55,25.72 16.2,25.72 15.56,25.08 15.56,20.95 JP6.3
N$32
  Bottom 0.406: IC2.5 20.64,30.8 21.91,32.07 JP4.1 26.99,32.07 27.63,32.07 27.63,20.95 JP6.4
N$33
  Bottom 0.406: IC2.3 11.43,29.53 10.16,30.8 JP5.1
N$34
  Bottom 0.406: IC2.2 JP5.2
N$35
  Bottom 0.406: Q2.1 49.68,44.95 49.68,50 49.16,50.52 48.71,50.52 | 48.71,50.52 C2.2 | IC1.13 49.68,53.83 49.68,52.26 48.71,51.29 48.71,50.52
N$36
  Bottom 0.406: IC1.32 39.37,72.15 C4.2
N$37
  Top 0.406: R24.2 8.91,76.13 LED10.C 5.81,76.13
N$38
  Bottom 0.406: IC1.30 44.54,69.12 C3.1 44.54,75.39 L1.1
N$39
  Bottom 0.406: JP8.5 40.32,43.93 40.32,52.58 39.37,53.53 IC1.9 39.37,56.7 R10.1
N$40
  Bottom 0.406: JP9.1 IC1.33
N$41
  Bottom 0.406: JP9.2 IC1.34
N$42
  Bottom 0.406: IC1.35 JP9.3
N$43
  Bottom 0.406: JP9.4 IC1.36
N$44
  Bottom 0.406: JP9.5 IC1.37
N$45
  Bottom 0.406: JP9.6 IC1.38
N$46
  Bottom 0.406: JP9.7 IC1.39
N$47
  Bottom 0.406: JP9.8 19.03,73.66 19.03,69.03 19.05,69.03 IC1.40
N$48
  Bottom 0.406: IC1.8 JP10.1 36.83,48.33 36.77,45.48 36.13,44.84 36.13,42.27 35.81,41.95 JP8.3
N$49  (1 unrouted)
  Bottom 0.406: IC1.7 JP10.2 | JP8.1 30.32,42.93 30.32,44.19 34.19,48.06 34.19,49.68
N$50
  Bottom 0.406: IC1.6 JP10.3 29.36,47.13 29.36,39.35 33.55,39.35 33.55,42.26 34.15,42.86 JP8.4
N$51
  Bottom 0.406: JP10.4 IC1.5
N$52
  Bottom 0.406: JP10.5 IC1.4
N$53
  Bottom 0.406: IC1.3 JP10.6
N$54
  Bottom 0.406: IC1.2 JP10.7
N$55
  Bottom 0.406: IC1.1 JP10.8
N$56
  Bottom 0.406: IC1.29 46.99,71.3 JP11.1
N$57
  Bottom 0.406: IC1.28 49.53,70.82 51.94,73.23 51.94,73.71 JP11.2
N$58
  Bottom 0.406: IC1.27 52.07,70.13 54.52,72.58 54.52,73.75 JP11.3
N$59
  Bottom 0.406: IC1.26 54.61,70.42 57.1,72.9 57.1,73.79 JP11.4
N$60
  Bottom 0.406: IC1.25 57.15,70.38 59.68,72.9 59.68,73.83 JP11.5
N$61
  Bottom 0.406: IC1.24 59.69,70.33 62.26,72.9 62.26,73.83 JP11.6
N$62
  Bottom 0.406: IC1.23 62.23,70.29 64.84,72.9 64.84,73.79 JP11.7
N$63
  Bottom 0.406: IC1.22 64.77,70.9 67.1,73.23 67.1,73.63 JP11.8
N$64
  Bottom 0.406: JP12.1 71.79,64.73 IC1.21
N$65
  Bottom 0.406: IC1.20 67.31,52.24 JP12.3
N$66
  Bottom 0.406: IC1.19 64.77,52.24 JP12.5
N$67
  Bottom 0.406: IC1.18 62.23,52.24 JP12.7
N$68
  Bottom 0.406: IC1.17 59.69,52.24 JP12.9
N$69
  Bottom 0.406: IC1.16 57.15,52.24 JP12.11
N$70
  Bottom 0.406: IC1.15 54.61,52.24 JP12.13
N$71
  Bottom 0.406: IC1.14 52.07,52.24 JP12.15
N$72  (via drill 0.6)
  Top 0.406: LED2.A v71.94,45.81 | v71.94,45.81
  Bottom 0.406: v71.94,45.81 71.94,47.62 JP12.2
N$73  (via drill 0.6)
  Top 0.406: LED3.A v69.36,45.81
  Bottom 0.406: v69.36,45.81 69.36,47.66 JP12.4
N$74  (via drill 0.6)
  Top 0.406: LED4.A v66.77,45.81
  Bottom 0.406: v66.77,45.81 66.77,47.7 JP12.6
N$75  (via drill 0.6)
  Top 0.406: LED5.A v64.19,45.81
  Bottom 0.406: v64.19,45.81 64.19,47.74 JP12.8
N$76  (via drill 0.6)
  Top 0.406: LED6.A v61.61,45.81
  Bottom 0.406: v61.61,45.81 61.61,47.74 JP12.10
N$77  (via drill 0.6)
  Top 0.406: LED7.A v59.03,45.81
  Bottom 0.406: v59.03,45.81 59.03,47.7 JP12.12
N$78  (via drill 0.6)
  Top 0.406: LED8.A v56.45,45.81
  Bottom 0.406: v56.45,45.81 56.45,47.66 JP12.14
N$79  (via drill 0.6)
  Top 0.406: LED9.A v53.87,45.81 | v53.87,45.81
  Bottom 0.406: v53.87,45.81 53.87,47.74 53.99,47.74 JP12.16
N$80
  Top 0.406: R11.2 LED2.C
N$81
  Top 0.406: R12.2 LED3.C
N$82
  Top 0.406: R13.2 LED4.C | LED4.C
N$83
  Top 0.406: R14.2 LED5.C | LED5.C
N$84
  Top 0.406: R15.2 LED6.C
N$85
  Top 0.406: R16.2 LED7.C
N$86
  Top 0.406: R17.2 LED8.C
N$87
  Top 0.406: R18.2 LED9.C
N$88  (via drill 0.6)
  other vias: 85.81,57.74
N$89
  Top 0.406: 85.97,57.74 95.97,57.74 95.97,57.9
N$92  (1 unrouted)
  Bottom 0.406: S1.4 89.03,39.36 89.03,39.35 | S1.3 88.39,39.36 83.55,34.52 83.55,30.89 JP14.1 | R19.1 82.58,30 JP14.1 | JP14.1
N$93
  Bottom 0.406: S2.4 S2.3 88.07,30.98 84.52,27.42 82.62,27.42 JP14.2 82.54,27.42 R20.1
N$94
  Bottom 0.406: S3.4 S3.3 87.09,22.59 84.84,24.84 JP14.3 | JP14.3 | R21.1 JP14.3 | JP14.3
N$95
  Bottom 0.406: S4.4 S4.3 89.01,14.86 86.13,17.74 86.13,21.29 85.16,22.26 82.62,22.26 JP14.4 82.54,22.26 R22.1
N$96
  Bottom 0.406: S5.4 S5.3 88.7,5.81 82.58,11.94 JP14.5 | JP14.5 | R23.1 82.5,19.68 JP14.5
(copper drawn outside any net)
  shapes: Top area x1, Top circle x4

### Text on the board
Top: MariK's DemoBoard v 1.0 | zzzMariKzzz@gmail.com | © 2012